# Altium schematic sheet 03_MCU.SchDoc: ECE315 MCU
size A; Date: 4/25/2017; ApprovedBy: JSK; CheckedBy: JSK; Author: JSK; CompanyName: University of Wisconsin; DrawnBy: JSK; Engineer: JSK; Organization: ECE 315; Address1: College of Engineering; Address2: 1415 Engineering Drive; Address3: Madison, WI 53706; Address4: ECE 315 Fall 2017; Revision: A; SheetNumber: 3; SheetTotal: 6; AssemblyNumber: ECE315-F19; ApprovedDate: 04/02/2019
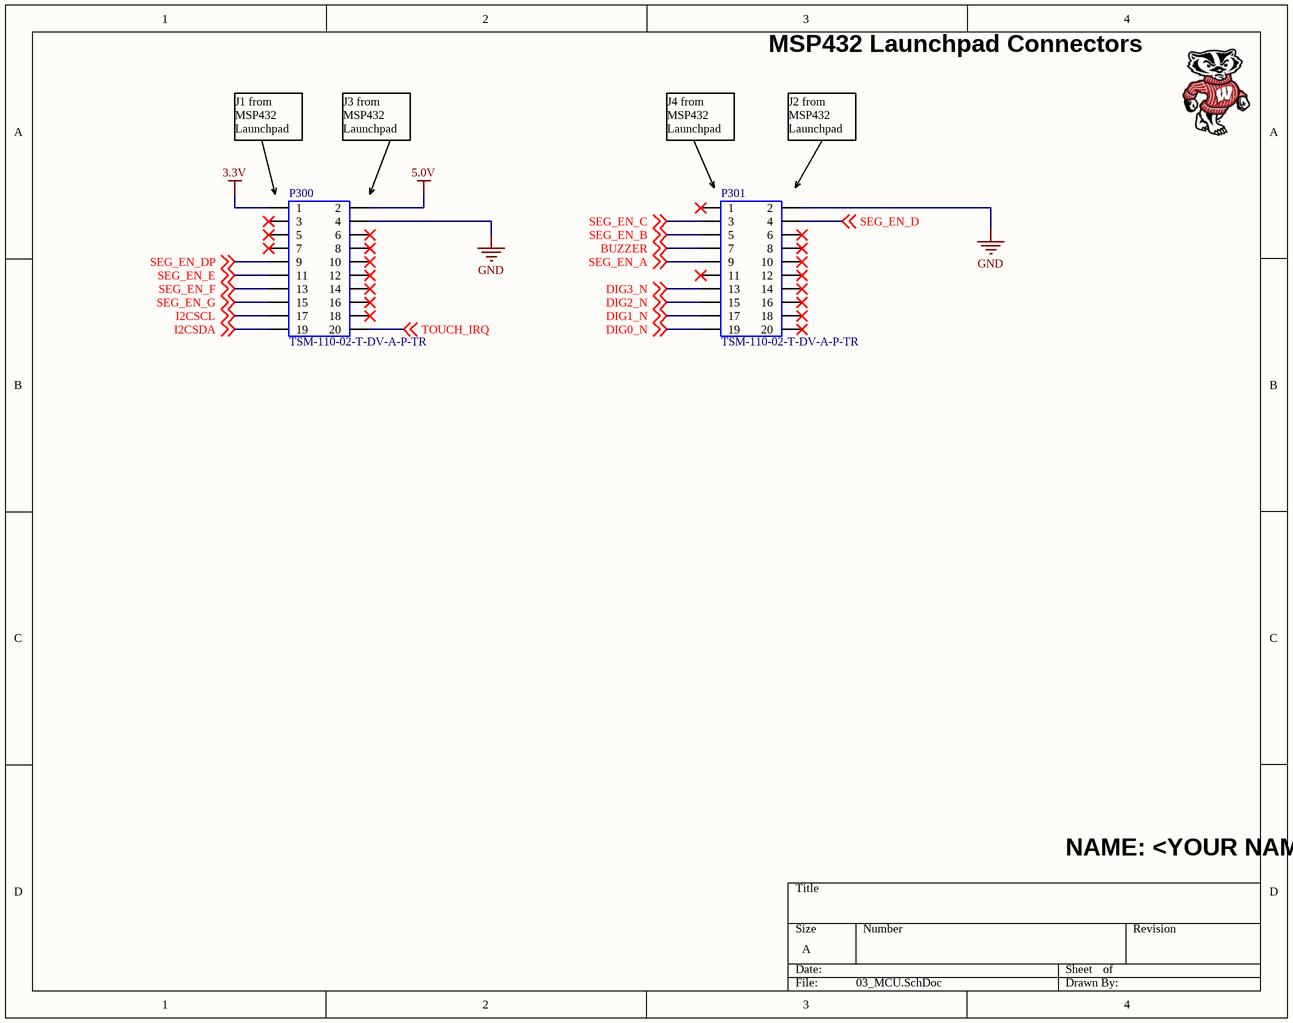
[diagram p0: 03_MCU.SchDoc]

## Parts
P300  Manufacturer Part Number: TSM-110-02-T-DV-A-P-TR  [TMS-110-01-T-DV-A]  (hidden comment: 20 Pin SMD)
P301  Manufacturer Part Number: TSM-110-02-T-DV-A-P-TR  [TMS-110-01-T-DV-A]  (hidden comment: 20 Pin SMD)

## Nets
3.3V: P300.1
5.0V: P300.2
GND: P300.4 P301.2
BUZZER: P301.7 ; off-sheet BUZZER
DIG0_N: P301.19 ; off-sheet DIG0_N
DIG1_N: P301.17 ; off-sheet DIG1_N
DIG2_N: P301.15 ; off-sheet DIG2_N
DIG3_N: P301.13 ; off-sheet DIG3_N
I2CSCL: P300.17 ; off-sheet I2CSCL
I2CSDA: P300.19 ; off-sheet I2CSDA
SEG_EN_A: P301.9 ; off-sheet SEG_EN_A
SEG_EN_B: P301.5 ; off-sheet SEG_EN_B
SEG_EN_C: P301.3 ; off-sheet SEG_EN_C
SEG_EN_D: P301.4 ; off-sheet SEG_EN_D
SEG_EN_DP: P300.9 ; off-sheet SEG_EN_DP
SEG_EN_E: P300.11 ; off-sheet SEG_EN_E
SEG_EN_F: P300.13 ; off-sheet SEG_EN_F
SEG_EN_G: P300.15 ; off-sheet SEG_EN_G
TOUCH_IRQ: P300.20 ; off-sheet TOUCH_IRQ

Not connected (* = marked no-connect by the designer): P300 3* 5* 6* 7* 8* 10* 12* 14* 16* 18*; P301 1* 6* 8* 10* 11* 12* 14* 16* 18* 20*

## Notes on the sheet
- MSP432 Launchpad Connectors
- J1 from MSP432 Launchpad
- J3 from MSP432 Launchpad
- J4 from MSP432 Launchpad
- J2 from MSP432 Launchpad
- NAME: <YOUR NAME>

## Library data of the parts
P300 P301 = TSM-110-02-T-DV-A: Conn Unshrouded Header HDR 20 POS 2.54mm Solder ST SMD Tube; Supplier 1: Newark; Supplier Part Number 1: 78P2391